# Altium schematic sheet Main.SchDoc
size A3; SheetNumber: 2; SheetTotal: 6
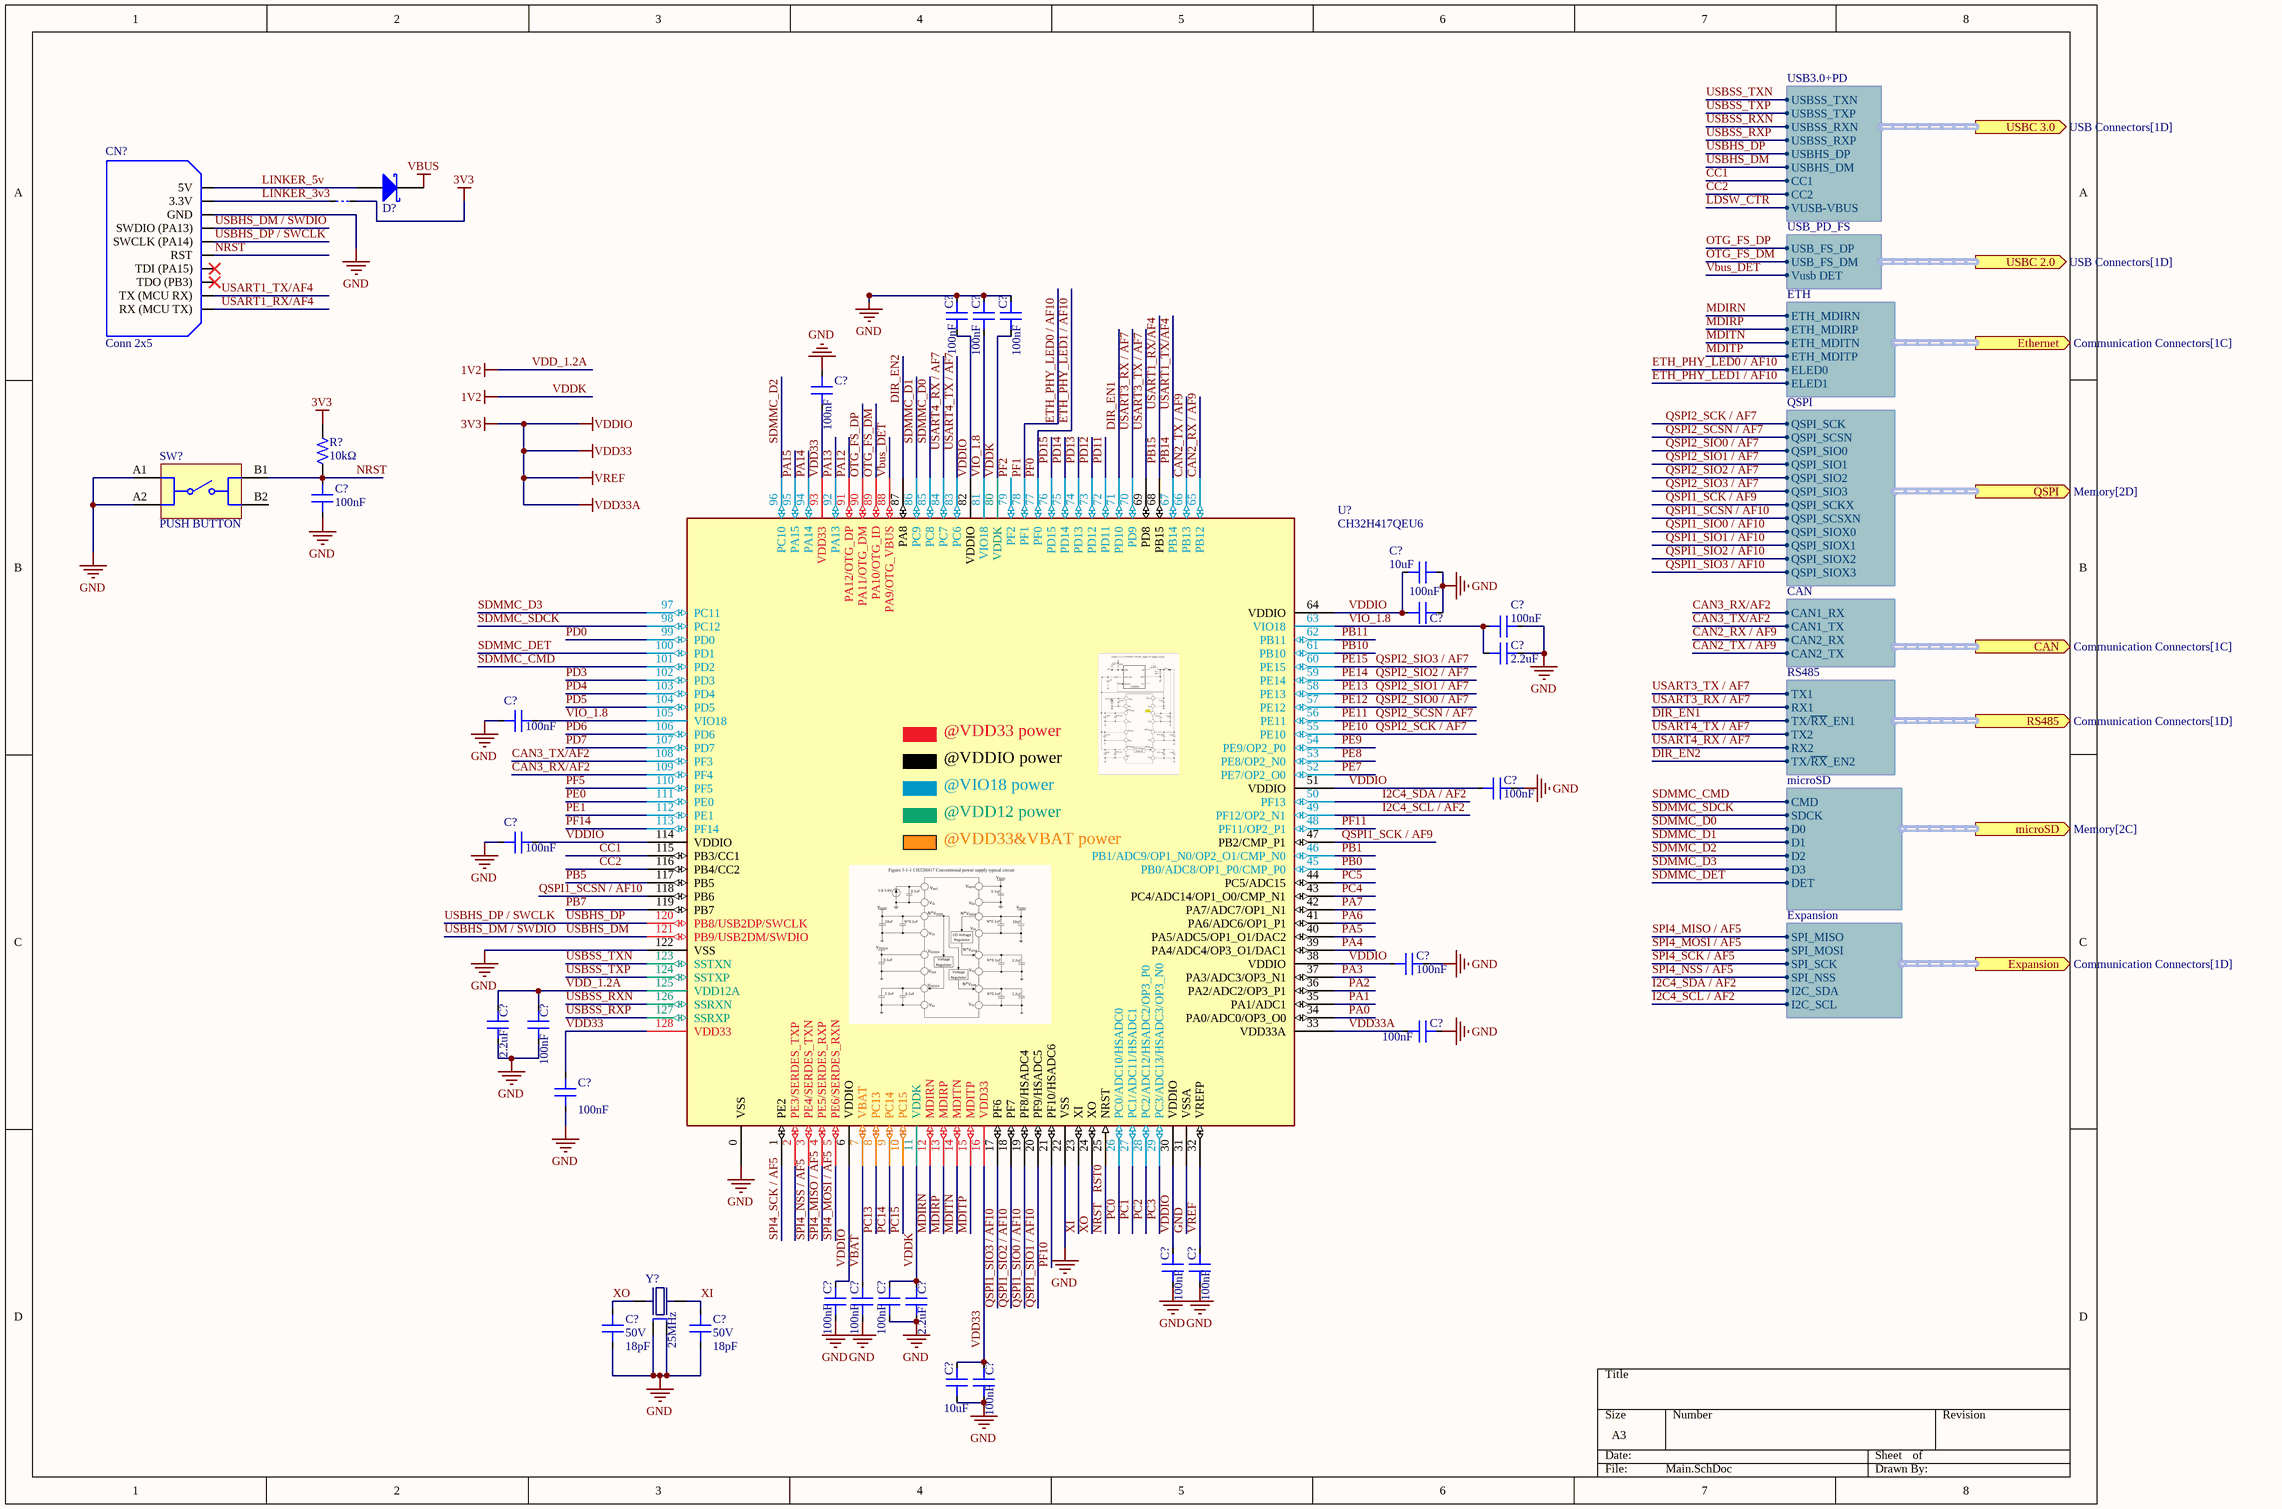
[diagram p0: Main.SchDoc]

## Parts
(Parts that share a designator on the sheet are numbered #1, #2 ... from top to bottom, then left to right.)
C?#1  Capacitance: 100nF  [C_0603]  (hidden comment: CAP CER 100nF 50V X7R 0603)
C?#2  Capacitance: 100nF  [C_0603]  (hidden comment: CAP CER 100nF 50V X7R 0603)
C?#3  Capacitance: 100nF  [C_0603]  (hidden comment: CAP CER 100nF 50V X7R 0603)
C?#4  Capacitance: 100nF  [C_0603]  (hidden comment: CAP CER 100nF 50V X7R 0603)
C?#5  Capacitance: 100nF  [C_0603]  (hidden comment: CAP CER 100nF 50V X7R 0603)
C?#6  Capacitance: 10uF  [C_0805]  (hidden comment: CAP CER 10uF 16V X7R 0805)
C?#7  Capacitance: 100nF  [C_0603]  (hidden comment: CAP CER 100nF 50V X7R 0603)
C?#8  Capacitance: 100nF  [C_0603]  (hidden comment: CAP CER 100nF 50V X7R 0603)
C?#9  Capacitance: 2.2uF  [C_0603]  (hidden comment: CAP CER 2.2uF 16V X5R 0603)
C?#10  Capacitance: 100nF  [C_0603]  (hidden comment: CAP CER 100nF 50V X7R 0603)
C?#11  Capacitance: 100nF  [C_0603]  (hidden comment: CAP CER 100nF 50V X7R 0603)
C?#12  Capacitance: 100nF  [C_0603]  (hidden comment: CAP CER 100nF 50V X7R 0603)
C?#13  Capacitance: 100nF  [C_0603]  (hidden comment: CAP CER 100nF 50V X7R 0603)
C?#14  Capacitance: 2.2uF  [C_0603]  (hidden comment: CAP CER 2.2uF 16V X5R 0603)
C?#15  Capacitance: 100nF  [C_0603]  (hidden comment: CAP CER 100nF 50V X7R 0603)
C?#16  Capacitance: 100nF  [C_0603]  (hidden comment: CAP CER 100nF 50V X7R 0603)
C?#17  Capacitance: 100nF  [C_0603]  (hidden comment: CAP CER 100nF 50V X7R 0603)
C?#18  Capacitance: 100nF  [C_0603]  (hidden comment: CAP CER 100nF 50V X7R 0603)
C?#19  Capacitance: 100nF  [C_0603]  (hidden comment: CAP CER 100nF 50V X7R 0603)
C?#20  Capacitance: 100nF  [C_0603]  (hidden comment: CAP CER 100nF 50V X7R 0603)
C?#21  Capacitance: 100nF  [C_0603]  (hidden comment: CAP CER 100nF 50V X7R 0603)
C?#22  Capacitance: 100nF  [C_0603]  (hidden comment: CAP CER 100nF 50V X7R 0603)
C?#23  Capacitance: 2.2uF  [C_0603]  (hidden comment: CAP CER 2.2uF 16V X5R 0603)
C?#24  Voltage Rating: 50V  Capacitance: 18pF  [C_0603]  (hidden comment: CAP CER 18pF 50V C0G 0603)
C?#25  Voltage Rating: 50V  Capacitance: 18pF  [C_0603]  (hidden comment: CAP CER 18pF 50V C0G 0603)
C?#26  Capacitance: 10uF  [C_0805]  (hidden comment: CAP CER 10uF 16V X7R 0805)
C?#27  Capacitance: 100nF  [C_0603]  (hidden comment: CAP CER 100nF 50V X7R 0603)
CN?  Conn 2x5  [IDC_2x5P_2.54MM_TH]
D?  DIODE SCHOTTKY 40V SOD-323  [SOD323]  (value not drawn)
J?  JUMPER SMD  [JUMPER SMD 3X1.5 mm]  (value not drawn)  (no BOM)
R?  Resistance: 10kΩ  [R_0603]  (hidden comment: RES 10kΩ ±1% 100mW 0603)
SW?  PUSH BUTTON  [Tact Switch 6X6X9.5MM]
U?  CH32H417QEU6  [QFN128_12.3X12.3]
Y?  Frequency: 25MHz  [XTAL_SMD3225-4P]  (hidden comment: CRYSTAL 25MHz 12pF SMD)

## Ports
CAN (out, harness CAN, see Communication Connectors[1C]), Ethernet (out, harness ETH, see Communication Connectors[1C]), Expansion (out, harness Expansion, see Communication Connectors[1D]), microSD (out, harness microSD, see Memory[2C]), QSPI (out, harness QSPI, see Memory[2D]), RS485 (out, harness RS485, see Communication Connectors[1D]), USBC 2.0 (out, harness USB_PD_FS, see USB Connectors[1D]), USBC 3.0 (out, harness USB3.0+PD, see USB Connectors[1D])

## Harnesses
USB_PD_FS: USB_FS_DP, USB_FS_DM, Vusb DET
USB3.0+PD: USBHS_DM, USBHS_DP, USBSS_RXP, USBSS_RXN, USBSS_TXP, USBSS_TXN, CC1, CC2, VUSB-VBUS
ETH: ETH_MDIRN, ETH_MDIRP, ETH_MDITN, ETH_MDITP, ELED0, ELED1
QSPI: QSPI_SCK, QSPI_SCSN, QSPI_SIO0, QSPI_SIO1, QSPI_SIO2, QSPI_SIO3, QSPI_SCSXN, QSPI_SIOX0, QSPI_SIOX1, QSPI_SIOX2, QSPI_SIOX3, QSPI_SCKX
CAN: CAN1_RX, CAN1_TX, CAN2_TX, CAN2_RX
RS485: TX1, RX1, TX/~{R}~{X}_EN1, TX2, RX2, TX/~{R}~{X}_EN2
microSD: CMD, SDCK, D0, D1, D2, D3, DET
Expansion: SPI_MISO, SPI_MOSI, SPI_SCK, SPI_NSS, I2C_SDA, I2C_SCL

## Nets
GND: C?#1.1 C?#2.1 C?#3.1 C?#4.1 C?#5.1 C?#6.2 C?#7.1 C?#8.1 C?#9.2 C?#10.1 C?#11.1 C?#12.2 C?#13.2 C?#14.2 C?#15.2 C?#16.2 C?#17.2 C?#18.2 C?#19.2 C?#20.2 C?#21.2 C?#22.1 C?#23.1 C?#24.1 C?#25.1 C?#26.2 C?#27.2 CN?.5(GND) SW?.A1 SW?.A2 U?.0(VSS) U?.22(VSS) U?.31(VSSA) U?.122(VSS) Y?.2(GND) Y?.4(GND)
VBUS: D?.2(K)
VDD33: C?#1.2 C?#4.2 C?#6.1 C?#7.2 C?#11.2 C?#12.1 C?#13.1 C?#16.1 C?#17.1 C?#18.1 C?#19.1 C?#22.2 C?#26.1 C?#27.1 J?.1 R?.2 U?.6(VDDIO) U?.16(VDD33) U?.30(VDDIO) U?.32(VREFP) U?.33(VDD33A) U?.38(VDDIO) U?.51(VDDIO) U?.64(VDDIO) U?.82(VDDIO) U?.93(VDD33) U?.114(VDDIO) U?.128(VDD33)  [also labelled 3V3, VDD33A, VDDIO, VREF]
VDD_1.2A: C?#3.2 C?#14.1 C?#15.1 C?#21.1 C?#23.2 U?.11(VDDK) U?.80(VDDK) U?.125(VDD12A)  [also labelled 1V2, VDDK]
CAN2_RX / AF9: U?.65(PB12) ; port CAN.CAN2_RX
CAN2_TX / AF9: U?.66(PB13) ; port CAN.CAN2_TX
CAN3_RX/AF2: U?.109(PF4) ; port CAN.CAN1_RX
CAN3_TX/AF2: U?.108(PF3) ; port CAN.CAN1_TX
CC1: U?.115(PB3/CC1) ; port USBC 3.0.CC1
CC2: U?.116(PB4/CC2) ; port USBC 3.0.CC2
DIR_EN1: U?.71(PD10) ; port RS485.TX/~{R}~{X}_EN1
DIR_EN2: U?.87(PA8) ; port RS485.TX/~{R}~{X}_EN2
ETH_PHY_LED0 / AF10: U?.78(PF1) ; port Ethernet.ELED0  [also labelled PF1]
ETH_PHY_LED1 / AF10: U?.77(PF0) ; port Ethernet.ELED1  [also labelled PF0]
I2C4_SCL / AF2: U?.49(PF12/OP2_N1) ; port Expansion.I2C_SCL
I2C4_SDA / AF2: U?.50(PF13) ; port Expansion.I2C_SDA
LDSW_CTR: port USBC 3.0.VUSB-VBUS
LINKER_3v3: CN?.3(3.3V) J?.2(G)
LINKER_5v: CN?.1(5V) D?.1(A)
MDIRN: U?.12(MDIRN) ; port Ethernet.ETH_MDIRN
MDIRP: U?.13(MDIRP) ; port Ethernet.ETH_MDIRP
MDITN: U?.14(MDITN) ; port Ethernet.ETH_MDITN
MDITP: U?.15(MDITP) ; port Ethernet.ETH_MDITP
NRST: C?#5.2 CN?.2(RST) R?.1 SW?.B1 U?.25(NRST)  [also labelled RST0]
OTG_FS_DM: U?.89(PA10/OTG_ID) ; port USBC 2.0.USB_FS_DM
OTG_FS_DP: U?.90(PA11/OTG_DM) ; port USBC 2.0.USB_FS_DP
PA0: U?.34(PA0/ADC0/OP3_O0)
PA1: U?.35(PA1/ADC1)
PA2: U?.36(PA2/ADC2/OP3_P1)
PA3: U?.37(PA3/ADC3/OP3_N1)
PA4: U?.39(PA4/ADC4/OP3_O1/DAC1)
PA5: U?.40(PA5/ADC5/OP1_O1/DAC2)
PA6: U?.41(PA6/ADC6/OP1_P1)
PA7: U?.42(PA7/ADC7/OP1_N1)
PA12: U?.91(PA12/OTG_DP)
PA13: U?.92(PA13)
PA14: U?.94(PA14)
PA15: U?.95(PA15)
PB0: U?.45(PB0/ADC8/OP1_P0/CMP_P0)
PB1: U?.46(PB1/ADC9/OP1_N0/OP2_O1/CMP_N0)
PB5: U?.117(PB5)
PB7: U?.119(PB7)
PB10: U?.61(PB10)
PB11: U?.62(PB11)
PB14: CN?.8(TX_(MCU_RX)) U?.67(PB14)  [also labelled USART1_TX/AF4]
PB15: CN?.10(RX_(MCU_TX)) U?.68(PB15)  [also labelled USART1_RX/AF4]
PC0: U?.26(PC0/ADC10/HSADC0)
PC1: U?.27(PC1/ADC11/HSADC1)
PC2: U?.28(PC2/ADC12/HSADC2/OP3_P0)
PC3: U?.29(PC3/ADC13/HSADC3/OP3_N0)
PC4: U?.43(PC4/ADC14/OP1_O0/CMP_N1)
PC5: U?.44(PC5/ADC15)
PC13: U?.8(PC13)
PC14: U?.9(PC14)
PC15: U?.10(PC15)
PD0: U?.99(PD0)
PD3: U?.102(PD3)
PD4: U?.103(PD4)
PD5: U?.104(PD5)
PD6: U?.106(PD6)
PD7: U?.107(PD7)
PD11: U?.72(PD11)
PD12: U?.73(PD12)
PD13: U?.74(PD13)
PD14: U?.75(PD14)
PD15: U?.76(PD15)
PE0: U?.111(PE0)
PE1: U?.112(PE1)
PE7: U?.52(PE7/OP2_O0)
PE8: U?.53(PE8/OP2_N0)
PE9: U?.54(PE9/OP2_P0)
PE10: U?.55(PE10) ; port QSPI.QSPI_SCK  [also labelled QSPI2_SCK / AF7]
PE11: U?.56(PE11) ; port QSPI.QSPI_SCSN  [also labelled QSPI2_SCSN / AF7]
PE12: U?.57(PE12) ; port QSPI.QSPI_SIO0  [also labelled QSPI2_SIO0 / AF7]
PE13: U?.58(PE13) ; port QSPI.QSPI_SIO1  [also labelled QSPI2_SIO1 / AF7]
PE14: U?.59(PE14) ; port QSPI.QSPI_SIO2  [also labelled QSPI2_SIO2 / AF7]
PE15: U?.60(PE15) ; port QSPI.QSPI_SIO3  [also labelled QSPI2_SIO3 / AF7]
PF2: U?.79(PF2)
PF5: U?.110(PF5)
PF10: U?.21(PF10/HSADC6)
PF11: U?.48(PF11/OP2_P1)
PF14: U?.113(PF14)
QSPI1_SCK / AF9: U?.47(PB2/CMP_P1) ; port QSPI.QSPI_SCKX
QSPI1_SCSN / AF10: U?.118(PB6) ; port QSPI.QSPI_SCSXN
QSPI1_SIO0 / AF10: U?.19(PF8/HSADC4) ; port QSPI.QSPI_SIOX0
QSPI1_SIO1 / AF10: U?.20(PF9/HSADC5) ; port QSPI.QSPI_SIOX1
QSPI1_SIO2 / AF10: U?.18(PF7) ; port QSPI.QSPI_SIOX2
QSPI1_SIO3 / AF10: U?.17(PF6) ; port QSPI.QSPI_SIOX3
SDMMC_CMD: U?.101(PD2) ; port microSD.CMD
SDMMC_D0: U?.85(PC8) ; port microSD.D0
SDMMC_D1: U?.86(PC9) ; port microSD.D1
SDMMC_D2: U?.96(PC10) ; port microSD.D2
SDMMC_D3: U?.97(PC11) ; port microSD.D3
SDMMC_DET: U?.100(PD1) ; port microSD.DET
SDMMC_SDCK: U?.98(PC12) ; port microSD.SDCK
SPI4_MISO / AF5: U?.4(PE5/SERDES_RXP) ; port Expansion.SPI_MISO
SPI4_MOSI / AF5: U?.5(PE6/SERDES_RXN) ; port Expansion.SPI_MOSI
SPI4_NSS / AF5: U?.3(PE4/SERDES_TXN) ; port Expansion.SPI_NSS
SPI4_SCK / AF5: U?.1(PE2) ; port Expansion.SPI_SCK
USART3_RX / AF7: U?.70(PD9) ; port RS485.RX1
USART3_TX / AF7: U?.69(PD8) ; port RS485.TX1
USART4_RX / AF7: U?.84(PC7) ; port RS485.RX2
USART4_TX / AF7: U?.83(PC6) ; port RS485.TX2
USBHS_DM: CN?.7(SWDIO_(PA13)) U?.121(PB9/USB2DM/SWDIO) ; port USBC 3.0.USBHS_DM  [also labelled USBHS_DM / SWDIO]
USBHS_DP: CN?.9(SWCLK_(PA14)) U?.120(PB8/USB2DP/SWCLK) ; port USBC 3.0.USBHS_DP  [also labelled USBHS_DP / SWCLK]
USBSS_RXN: U?.126(SSRXN) ; port USBC 3.0.USBSS_RXN
USBSS_RXP: U?.127(SSRXP) ; port USBC 3.0.USBSS_RXP
USBSS_TXN: U?.123(SSTXN) ; port USBC 3.0.USBSS_TXN
USBSS_TXP: U?.124(SSTXP) ; port USBC 3.0.USBSS_TXP
VBAT: C?#20.1 U?.7(VBAT)
Vbus_DET: U?.88(PA9/OTG_VBUS) ; port USBC 2.0.Vusb DET
VIO_1.8: C?#2.2 C?#8.2 C?#9.1 C?#10.2 U?.63(VIO18) U?.81(VIO18) U?.105(VIO18)
XI: C?#25.2 U?.23(XI) Y?.1(XTAL1)
XO: C?#24.2 U?.24(XO) Y?.3(XTAL2)

Not connected (* = marked no-connect by the designer): CN? 4(TDI_(PA15))* 6(TDO_(PB3))*; SW? B2; U? 2(PE3/SERDES_TXP)

## Notes on the sheet
- (in symbol CH32H417QET6) @VDD33 power; @VDDIO power; @VIO18 power; @VDD12 power; @VDD33&VBAT power

## Library data of the parts
C?#1-C?#5 C?#7 C?#8 C?#10-C?#13 C?#15-C?#22 C?#27 = CC0603KRX7R9BB104: 100nF ±10% 50V Ceramic Capacitor X7R 0603; Manufacturer: YAGEO; Symbol Path 1: Symbols\Standard.SchLib; Unit Price (USD): 0.0175; Voltage Rating: 50V; MPN: CC0603KRX7R9BB104; LCSC Part #: C14663; Package: 0603; JLC Part Type: Basic; LCSC Stock: 10701000; JLC Stock: 72739428; MOQ: 50; Datasheet: https://datasheet.lcsc.com/datasheet/pdf/23ccee80ee542e7cf156a772bb589942.pdf?productCode=C14663; URL: https://www.lcsc.com/product-detail/C14663.html; Status: ok; Tolerance: ±10%; TempCo: X7R
C?#6 C?#26 = CL21B106KOQNNNE: 10uF ±10% 16V Ceramic Capacitor X7R 0805; Manufacturer: Samsung Electro-Mechanics; Symbol Path 1: Symbols\Standard.SchLib; Unit Price (USD): 0.1057; Voltage Rating: 16V; MPN: CL21B106KOQNNNE; LCSC Part #: C95841; Package: 0805; JLC Part Type: Extended; LCSC Stock: 472010; JLC Stock: 550231; MOQ: 10; Datasheet: https://datasheet.lcsc.com/datasheet/pdf/02336ea48ea44ca18c72517dd3cb7b47.pdf?productCode=C95841; URL: https://www.lcsc.com/product-detail/C95841.html; Status: ok; Tolerance: ±10%; TempCo: X7R
C?#9 C?#14 C?#23 = CL10A225KO8NNNC: 2.2uF ±10% 16V Ceramic Capacitor X5R 0603; Manufacturer: Samsung Electro-Mechanics; Symbol Path 1: Symbols\Standard.SchLib; Unit Price (USD): 0.0195; Voltage Rating: 16V; MPN: CL10A225KO8NNNC; LCSC Part #: C23630; Package: 0603; JLC Part Type: Basic; LCSC Stock: 2699650; JLC Stock: 4726599; MOQ: 50; Datasheet: https://datasheet.lcsc.com/datasheet/pdf/02336ea48ea44ca18c72517dd3cb7b47.pdf?productCode=C23630; URL: https://www.lcsc.com/product-detail/C23630.html; Status: ok; Tolerance: ±10%; TempCo: X5R
C?#24 C?#25 = C1647: 18pF ±5% 50V Ceramic Capacitor C0G 0603; Manufacturer: Samsung Electro-Mechanics; MPN: CL10C180JB8NNNC; Symbol Path 1: Symbols\Standard.SchLib; Unit Price (USD): 0.0118; LCSC Part #: C1647; Package: 0603; JLC Part Type: Basic; LCSC Stock: 129350; JLC Stock: 451288; MOQ: 50; Datasheet: https://datasheet.lcsc.com/datasheet/pdf/02336ea48ea44ca18c72517dd3cb7b47.pdf?productCode=C1647; URL: https://www.lcsc.com/product-detail/C1647.html; Status: ok; Tolerance: ±5%; TempCo: C0G
CN? = WCH LINKE Debugger connector: CONN For WCH LINKE Debugger; Supplier 1: LCSC; Supplier Part Number 1: C7501191; ComponentLink1Description: Datasheet; ComponentLink1URL: https://www.wch-ic.com/downloads/WCH-LinkUserManual_PDF.html; ComponentLink2Description: New link; ComponentLink2URL: https://www.ram-e-shop.com/shop/fc10-pcb-idc10-male-polarized-fc10-pcb-5991
D? = 1N5819WS: Diode 40V 1A Surface Mount SOD-323; Manufacturer: Guangdong Hottech; Symbol Path 1: Symbols\Standard.SchLib; Unit Price (USD): 0.0139; Forward Voltage: 600mV@1A; MPN: 1N5819WS; LCSC Part #: C191023; Package: SOD-323; JLC Part Type: Basic; LCSC Stock: 4984450; JLC Stock: 5626571; MOQ: 50; Datasheet: https://datasheet.lcsc.com/datasheet/pdf/c7a6590686b7be2f86b8eed4480e569c.pdf?productCode=C191023; URL: https://www.lcsc.com/product-detail/C191023.html; Status: ok; Voltage Rating: 40V; Current Rating: 1A; Subcategory: Schottky
R? = 0603WAF1002T5E: 10kΩ ±1% 100mW 0603 Thick Film Resistor; Manufacturer: UNI-ROYAL; Symbol Path 1: Symbols\Standard.SchLib; Unit Price (USD): 0.0067; Voltage Rating: 75V; TempCo: ±100ppm/℃; MPN: 0603WAF1002T5E; Package: 0603; Datasheet: https://datasheet.lcsc.com/datasheet/pdf/0a975aaa49b7c97f38a963127be4a823.pdf?productCode=C25804; Power: 100mW; LCSC Part #: C25804; JLC Part Type: Basic; LCSC Stock: 0; JLC Stock: 6329063; MOQ: 100; URL: https://www.lcsc.com/product-detail/C25804.html; Status: ok; Tolerance: ±1%; Composition: Thick Film Resistor
SW? = SH-6X6X8H-CJ: SWITCH PUSH BUTTON 2X2 6X6X9.5MM; Supplier 1: LCSC; Supplier Part Number 1: C42416249; ComponentLink1Description: MAKERS; ComponentLink1URL: https://makerselectronics.com/product/mini-push-button-4-pin-6x6x9-5mm
U? = CH32H417QET6: RISC-V FPU HD-MCU, 384MHz, USB3.0 & PD, 100M Ethernet, DVP, SDMMC, QSPI, OPA, ADC, DAC
Y? = X322525MOB4SI: Crystal 25MHz ±10ppm 12pF SMD3225-4P; Manufacturer: YXC Crystal Oscillators; Symbol Path 1: Symbols\Standard.SchLib; Unit Price (USD): 0.0954; Stability: ±20ppm; ESR: 50Ω; MPN: X322525MOB4SI; LCSC Part #: C9006; Package: SMD3225-4P; JLC Part Type: Basic; LCSC Stock: 75190; JLC Stock: 176422; MOQ: 5; Datasheet: https://datasheet.lcsc.com/datasheet/pdf/a84bd8d530dd46e4b0f6d0ee59d8a89c.pdf?productCode=C9006; URL: https://www.lcsc.com/product-detail/C9006.html; Status: ok; Load Capacitance: 12pF; Tolerance: ±10ppm